# Altium schematic sheet ADC.SchDoc
size A; SheetNumber: 1; SheetTotal: 3
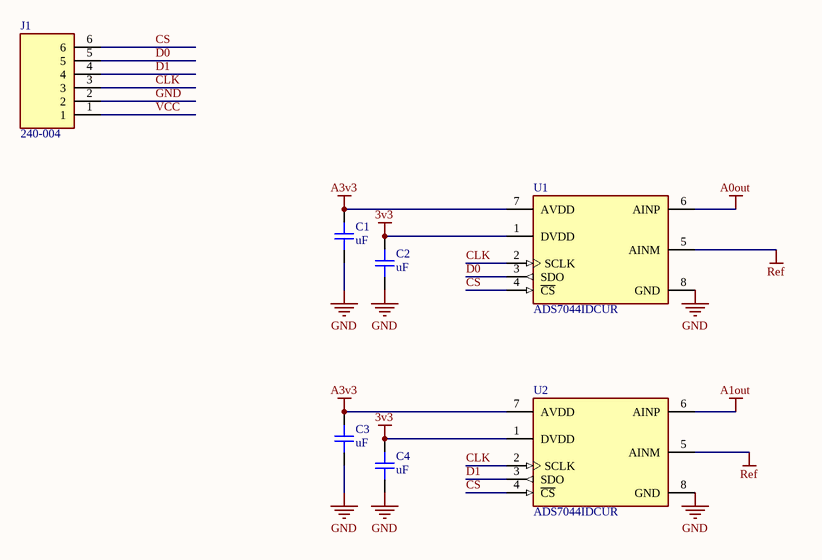
[diagram p0: ADC.SchDoc]

## Parts
C1  uF  [CAP_0603]
C2  uF  [CAP_0603]
C3  uF  [CAP_0603]
C4  uF  [CAP_0603]
J1  240-004  [HDRV6W64P0X254_1X6_1524X254X909P]
U1  ADS7044IDCUR  [FP-DCU0008A-MFG]
U2  ADS7044IDCUR  [FP-DCU0008A-MFG]

## Nets
3v3: C2.2 C4.2 U1.1(DVDD) U2.1(DVDD)
A0out: U1.6(AINP)
A1out: U2.6(AINP)
A3v3: C1.2 C3.2 U1.7(AVDD) U2.7(AVDD)
GND: C1.1 C2.1 C3.1 C4.1 J1.2 U1.8(GND) U2.8(GND)
Ref: U1.5(AINM) U2.5(AINM)
CLK: J1.3 U1.2(SCLK) U2.2(SCLK)
CS: J1.6 U1.4(~{CS}) U2.4(~{CS})
D0: J1.5 U1.3(SDO)
D1: J1.4 U2.3(SDO)
VCC: J1.1

## Library data of the parts
C1-C4 = CAP_0603: Capacitor SMD 0603; Manufacturer: *; Manufacturer Part Number: *; Distributor Link: *; LCSC: *; Rating: *; Dielectric: *
J1 = 240-004: Connector; Manufacturer_Name: Digilent; Datasheet Link: https://digilent.com/reference/_media/reference/test-and-measurement/6-pin-header-gender-changer/163-068-2.pdf; Height: 9.09mm; Manufacturer_Part_Number: 240-004; Arrow Part Number: 240-004; Arrow Price/Stock: https://www.arrow.com/en/products/240-004/digilent?region=nac
U1 U2 = CMP-04860-000057-1: IC ADC 12BIT SAR 8VSSOP; Resolution: 12b; Max Dual Supply Voltage: 3.6V; Polarity: Unipolar; Number of Bits: 12; Max Power Dissipation: 900uW; Integral Nonlinearity (INL): 2LSB; Operating Supply Voltage: 3V; Supply Type: Analog; Sampling Rate: 1000000S/s; Number of Inputs: 1; Interface: SPI; Min Dual Supply Voltage: 1.8V; Signal to Noise Ratio (SNR): 71dB; Number of Pins: 8; Min Operating Temperature: -40°C; RoHS Compliant: Yes; Mount: Surface Mount; Max Operating Temperature: 125°C; Contact Plating: Gold; Number of Analog Inputs: 1; Max Supply Voltage: 3.6V; Packaging: Tape and Reel; Number of A/D Converters: 1; Lead Free: Lead Free